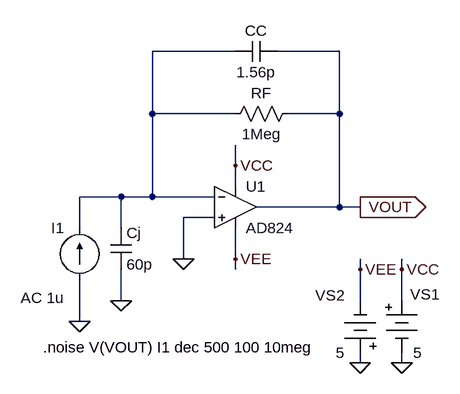
[diagram p0: schematic fig-03-03-25.asc]
fig-03-03-25.asc, the LTspice schematic file:
Version 4
SHEET 1 880 680
WIRE 208 -64 80 -64
WIRE 368 -64 272 -64
WIRE 80 32 80 -64
WIRE 208 32 80 32
WIRE 368 32 368 -64
WIRE 368 32 288 32
WIRE 208 112 208 80
WIRE 208 144 208 112
WIRE 32 160 -32 160
WIRE 80 160 80 32
WIRE 80 160 32 160
WIRE 176 160 80 160
WIRE 368 176 368 32
WIRE 368 176 240 176
WIRE 400 176 368 176
WIRE 176 192 128 192
WIRE -32 208 -32 160
WIRE 32 208 32 160
WIRE 128 256 128 192
WIRE 208 256 208 208
WIRE 208 272 208 256
WIRE 400 272 400 256
WIRE 464 272 464 256
WIRE 32 320 32 272
WIRE 400 320 400 272
WIRE 464 320 464 272
WIRE -32 352 -32 288
WIRE 400 416 400 400
WIRE 464 416 464 400
FLAG 128 256 0
FLAG -32 352 0
FLAG 400 176 VOUT
IOPIN 400 176 Out
FLAG 400 416 0
FLAG 464 416 0
FLAG 400 272 VEE
FLAG 464 272 VCC
FLAG 208 112 VCC
FLAG 208 256 VEE
FLAG 32 320 0
SYMBOL res 304 16 R90
WINDOW 0 0 56 VBottom 2
WINDOW 3 32 56 VTop 2
SYMATTR InstName RF
SYMATTR Value 1Meg
SYMBOL Misc\\battery 464 304 R0
WINDOW 0 13 6 Left 2
WINDOW 3 18 96 Left 2
WINDOW 123 0 0 Left 0
WINDOW 39 0 0 Left 0
SYMATTR InstName VS1
SYMATTR Value 5
SYMBOL Misc\\battery 400 416 R180
WINDOW 0 24 104 Left 2
WINDOW 3 24 16 Left 2
WINDOW 123 0 0 Left 0
WINDOW 39 0 0 Left 0
SYMATTR InstName VS2
SYMATTR Value 5
SYMBOL Opamps\\AD824 208 112 R0
SYMATTR InstName U1
SYMBOL cap 16 208 R0
SYMATTR InstName Cj
SYMATTR Value 60p
SYMBOL current -32 288 R180
WINDOW 0 24 80 Left 2
WINDOW 3 24 0 Left 2
WINDOW 123 24 -28 Left 2
WINDOW 39 0 0 Left 0
SYMATTR InstName I1
SYMATTR Value ""
SYMATTR Value2 AC 1u
SYMBOL cap 272 -80 R90
WINDOW 0 0 32 VBottom 2
WINDOW 3 32 32 VTop 2
SYMATTR InstName CC
SYMATTR Value 1.56p
TEXT -88 392 Left 2 !.noise V(VOUT) I1 dec 500 100 10meg

The netlist it stands for:
* fig-03-03-25.asc
RF VOUT N001 1Meg
VS1 VCC 0 5
VS2 0 VEE 5
XU1 0 N001 VCC VEE VOUT AD824  ; pins In+ In- V+ V- OUT
Cj N001 0 60p
I1 0 N001 AC 1u
CC VOUT N001 1.56p
.noise V(VOUT) I1 dec 500 100 10meg
.backanno
.end